# EAGLE design esposi-programmer-v1 (EAGLE 6.6.0)
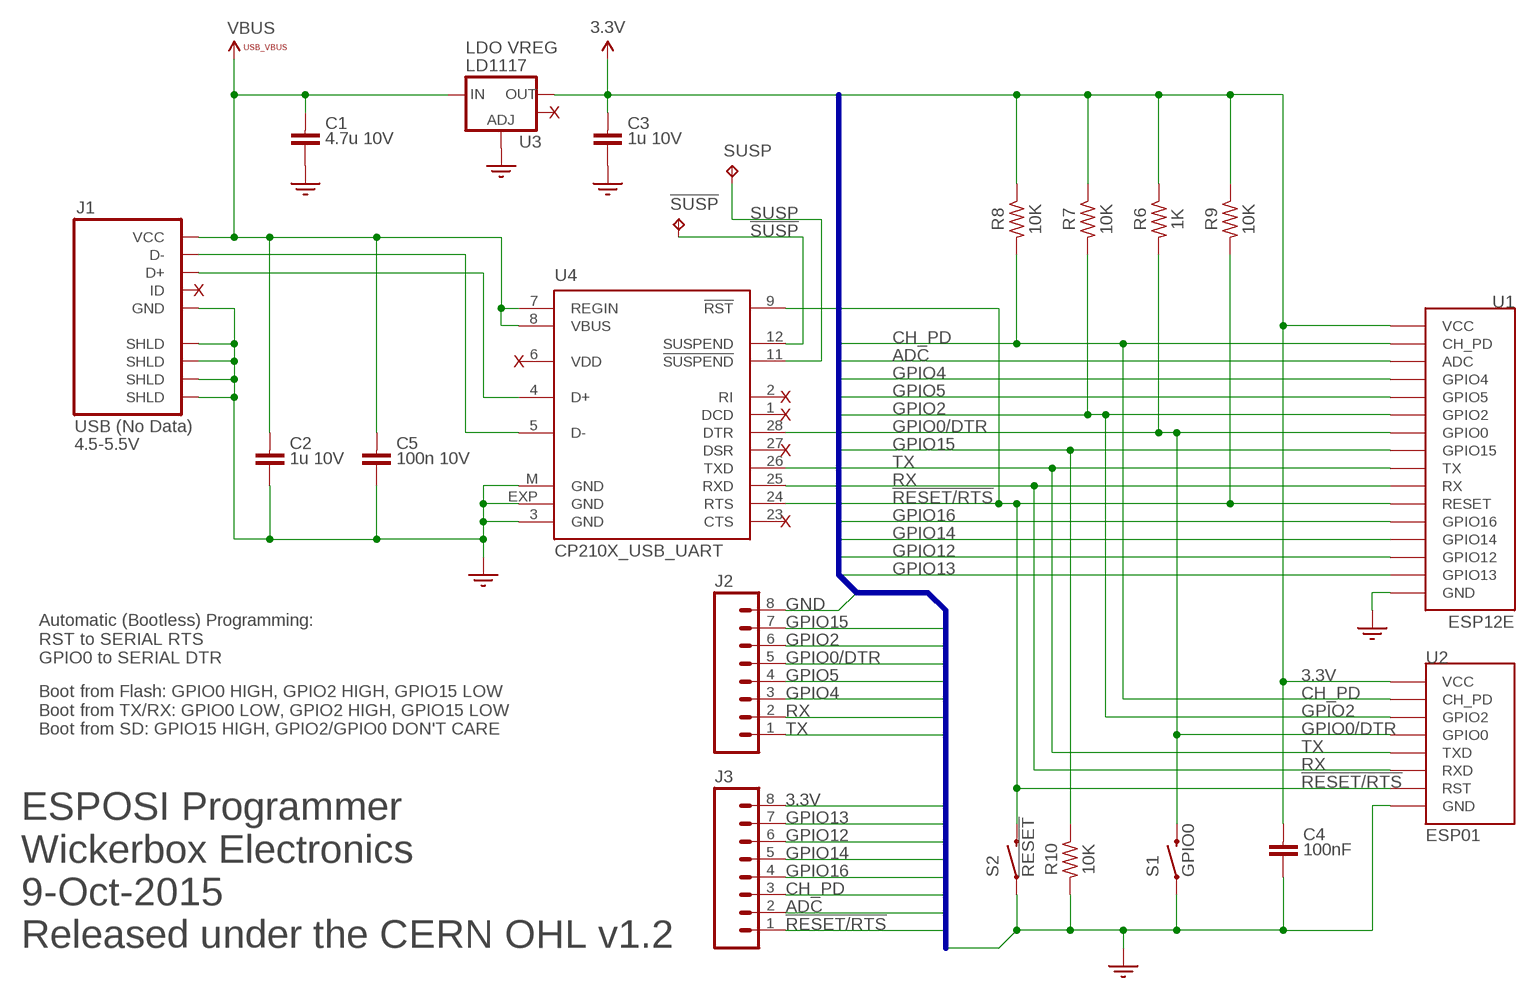
[diagram p0: schematic, sheet 1]

## Parts
!SUSP  TESTPAD_TPB1,27  [TESTPAD_B1,27]
C1  4.7u 10V  CAP-0805  [RLC-0805]
C2  1u 10V  CAP-0603  [RLC-0603]
C3  1u 10V  CAP-0603  [RLC-0603]
C4  100nF  CAP-0402  [RLC-0402]
C5  100n 10V  CAP-0402  [RLC-0402]
J1  USB (No Data)  ZX62D-B-5P8  [ZX62D-B-5P8]
J2  M08NO_SILK_FEMALE_PTH  [1X08_NO_SILK]
J3  M08NO_SILK_FEMALE_PTH  [1X08_NO_SILK]
R6  1K  RES-0402  [RLC-0402]
R7  10K  RES-0402  [RLC-0402]
R8  10K  RES-0402  [RLC-0402]
R9  10K  RES-0402  [RLC-0402]
R10  10K  RES-0402  [RLC-0402]
S1  GPIO0  SWITCH-MOMENTARY-2SMD-1101NE  [TACTILE-SWITCH-1101NE]
S2  !RESET  SWITCH-MOMENTARY-2SMD-1101NE  [TACTILE-SWITCH-1101NE]
SUSP  TESTPAD_TPB1,27  [TESTPAD_B1,27]
U1  ESP12E  ESP12-LONGTH  [ESP12]
U2  ESP01  ESP01-LONG  [ESP01]
U3  V_REG_LM1117SOT223  [SOT223]
U4  CP210X_USB_UART  [MLP28]

## Nets
3.3V: C3.2 C4.1 J3.8 R6.1 R7.1 R8.1 R9.1 U1.VCC U2.VCC U3.2(OUT)
!RESET/RTS: J3.1 R9.2 S2.2 U1.RESET U2.RST U4.9(!RST) U4.24(RTS)
!SUSP: !SUSP.TP U4.12(SUSPEND)
ADC: J3.2 U1.ADC
CH_PD: J3.3 R8.2 U1.CH_PD U2.CH_PD
D+: J1.P3(D+) U4.4(D+)
D-: J1.P2(D-) U4.5(D-)
GND: C1.2 C2.1 C3.1 C4.2 C5.2 J1.P5(GND) J1.P$1(SHLD) J1.P$2(SHLD) J1.P$3(SHLD) J1.P$4(SHLD) J2.8 R10.2 S1.1 S2.1 U1.GND U2.GND U3.1(ADJ) U4.3(GND) U4.EXP(GND) U4.M(GND)
GPIO0/DTR: J2.5 R6.2 S1.2 U1.GPIO0 U2.GPIO0 U4.28(DTR)
GPIO2: J2.6 R7.2 U1.GPIO2 U2.GPIO2
GPIO4: J2.3 U1.GPIO4
GPIO5: J2.4 U1.GPIO5
GPIO12: J3.6 U1.GPIO12
GPIO13: J3.7 U1.GPIO13
GPIO14: J3.5 U1.GPIO14
GPIO15: J2.7 R10.1 U1.GPIO15
GPIO16: J3.4 U1.GPIO16
RX: J2.2 U1.RX U2.RX(RXD) U4.25(RXD)
SUSP: SUSP.TP U4.11(!SUSPEND)
TX: J2.1 U1.TX U2.TX(TXD) U4.26(TXD)
VBUS: C1.1 C2.2 C5.1 J1.P1(VCC) U3.3(IN) U4.7(REGIN) U4.8(VBUS)
Unconnected: J1.P4(ID) U3.4(OUT) U4.1(DCD) U4.2(RI) U4.23(CTS) U4.27(DSR)

## Buses
CH_PD,ADC,GPIO4,GPIO5,GPIO2,GPIO0/DTR,GPIO15,TX,RX,!RESET/RTS,GPIO16,GPIO14,GPIO12,GPIO13,GND,3.3V

## Notes on the sheet
- LDO VREG
- LD1117
- X
- X
- X
- X
- X
- 4.5-5.5V | X
- X
- Automatic (Bootless) Programming:
  RST to SERIAL RTS
  GPIO0 to SERIAL DTR
- Boot from Flash: GPIO0 HIGH, GPIO2 HIGH, GPIO15 LOW
  Boot from TX/RX: GPIO0 LOW, GPIO2 HIGH, GPIO15 LOW
  Boot from SD: GPIO15 HIGH, GPIO2/GPIO0 DON'T CARE
- ESPOSI Programmer
  Wickerbox Electronics
  9-Oct-2015
  Released under the CERN OHL v1.2

## Power pins joined to a net without a drawn wire
VDD: U4.6(VDD)

## Library data of the parts
!SUSP SUSP = foxcar-control-board-v1:TESTPAD_TP: Test pad
C1 = max-viz:CAP-0805
C2 C3 = max-viz:CAP-0603
C4 C5 = max-viz:CAP-0402
J1 = con-hirose-microusb:ZX62D-B-5P8
J2 J3 = SparkFun-Connectors:M08: Header 8 Standard 8-pin 0.1" header. Use with straight break away headers (SKU : PRT-00116), right angle break away headers (PRT-00553), swiss pins (PRT-00743), machine pins (PRT-00117), and female headers (PRT-00115).; PROD_ID: CONN-08438
R6-R10 = max-viz:RES-0402
S1 S2 = SparkFun-Electromechanical:SWITCH-MOMENTARY-2: Various NO switches- pushbuttons, reed, etc; PROD_ID: SWCH-00815
U1 = esp8266modules:ESP12-LONG
U2 = esp8266modules:ESP01-LONG
U3 = SparkFun-PowerIC:V_REG_LM1117: Voltage Regulator LM1117 Standard adjustable voltage regulator but in SMD form. Spark Fun Electronics SKU : COM-00595; PROD_ID: VREG-08170
U4 = SparkFun-DigitalIC:CP210X_USB_UART: Single-Chip USB to UART Bridge Source: www.silabs.com .. CP2101.pdf / cp2102.pdf. Spark Fun Electronics SKU : COM-00310

## Net classes
0 default: clearance 0.178 mm

## Board
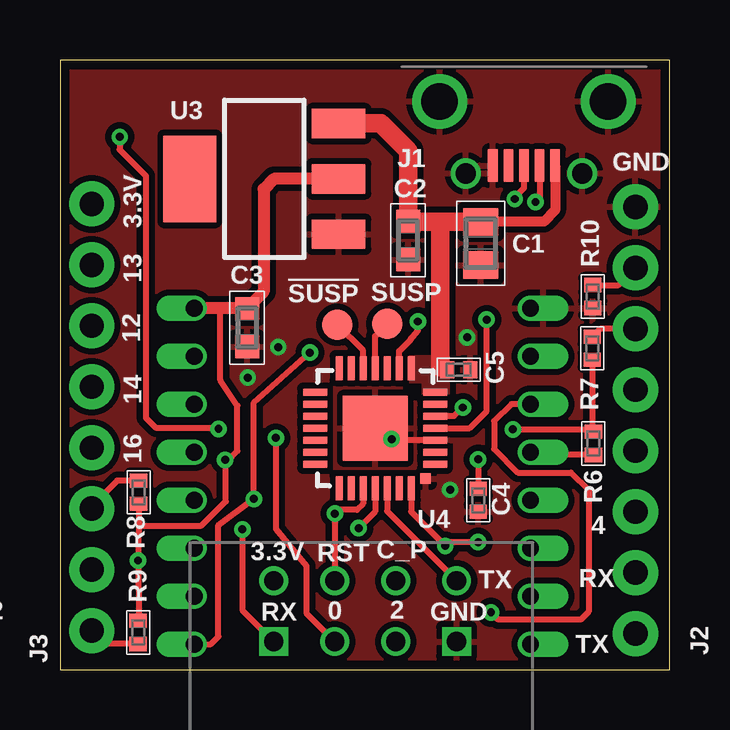
[diagram p1: board, top side]
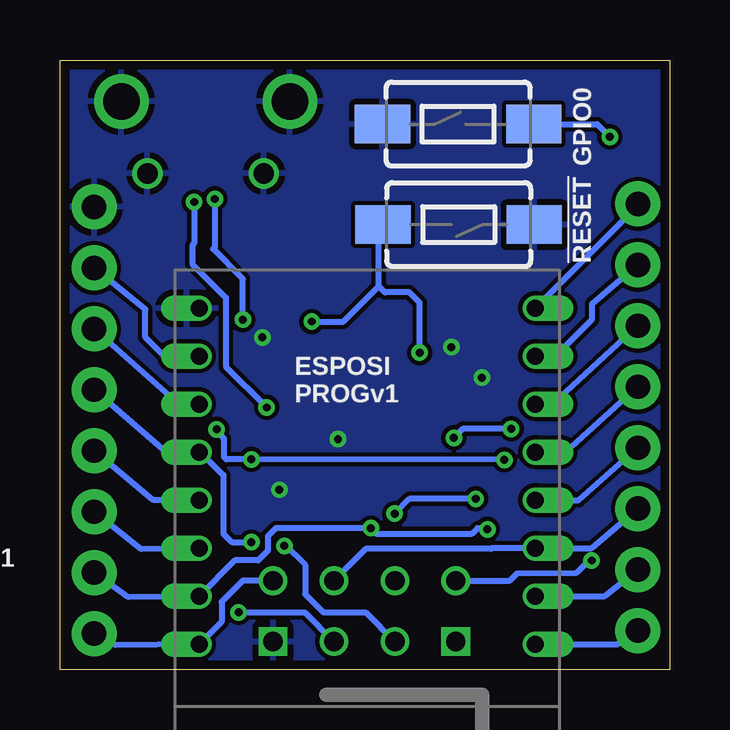
[diagram p2: board, bottom side, seen from below]

Size 25.4 x 25.4 mm. Coordinates in mm from the lower left corner, seen from the top.
Outline: 0,0 25.4,0 25.4,25.4 0,25.4 0,0
Copper layers (1*16): Top 0.0356mm / dielectric 1.5011mm / Bottom 0.0356mm
Design rules "oshpark-2layer": minimum track width 6mil, minimum drill 13mil, track to track 6mil, track to pad 6mil, pad to pad 6mil, via to via 6mil, smd to smd 6mil, copper to edge 15mil, drill to drill 6mil, minimum pad ring 7mil, minimum via ring 7mil, stop-mask expansion 4mil, vias tented up to drill 0mil, thermal gap 10mil

### Footprints (pad centres in the part's own frame; a part is rotated, then mirrored left to right if it is on the bottom)
TESTPAD_B1,27 = smd 1.27 x 1.27: TP 0,0
RLC-0805 = smd 1.15 x 1.45: 1 -0.9,0; 2 0.9,0
RLC-0603 = smd 0.95 x 1: 1 0.8,0; 2 -0.8,0
RLC-0402 = smd 0.59 x 0.72: 1 -0.48,0; 2 0.48,0
ZX62D-B-5P8 = smd 0.4 x 1.35: P1 -1.3,2.675; P2 -0.65,2.675; P3 0,2.675; P4 0.65,2.675; P5 1.3,2.675 | drill 1.524: P$1 3.51,0; P$2 -3.51,0 | drill 0.838: P$3 -2.425,3; P$4 2.425,3
1X08_NO_SILK = drill 1.016 pad 1.88: 1 0,0; 2 2.54,0; 3 5.08,0; 4 7.62,0; 5 10.16,0; 6 12.7,0; 7 15.24,0; 8 17.78,0
TACTILE-SWITCH-1101NE = smd 2.3 x 1.6: 1 -3.15,0; 2 3.15,0
ESP12 = drill 0.7 offset: ADC -7.1,3.8; CH_PD -7.1,1.8; GND 6.9,-8.2; GPIO0 6.9,-2.2; GPIO2 6.9,-4.2; GPIO4 6.9,1.8; GPIO5 6.9,-0.2; GPIO12 -7.1,-4.2; GPIO13 -7.1,-6.2; GPIO14 -7.1,-2.2; GPIO15 6.9,-6.2; GPIO16 -7.1,-0.2; RESET -7.1,5.8; RX 6.9,3.8; TX 6.9,5.8; VCC -7.1,-8.2
ESP01 = drill 0.8: CH_PD -1.285,-8.178; GPIO0 1.255,-5.638; GPIO2 -1.285,-5.638; RST 1.255,-8.178; TX -3.825,-8.178; VCC 3.795,-8.178 | drill 0.8 square: GND -3.825,-5.638; RX 3.795,-5.638
SOT223 = smd 1.219 x 2.235: 1 -2.311,-3.099; 2 0,-3.099; 3 2.311,-3.099 | smd 3.6 x 2.2: 4 0,3.099
MLP28 = smd 1 x 0.3: 1 -2.5,1.5; 2 -2.5,1; 3 -2.5,0.5; 4 -2.5,0; 5 -2.5,-0.5; 6 -2.5,-1; 7 -2.5,-1.5; 15 2.5,-1.5; 16 2.5,-1; 17 2.5,-0.5; 18 2.5,0; 19 2.5,0.5; 20 2.5,1; 21 2.5,1.5 | smd 0.3 x 1: 8 -1.5,-2.5; 9 -1,-2.5; 10 -0.5,-2.5; 11 0,-2.5; 12 0.5,-2.5; 13 1,-2.5; 14 1.5,-2.5; 22 1.5,2.5; 23 1,2.5; 24 0.5,2.5; 25 0,2.5; 26 -0.5,2.5; 27 -1,2.5; 28 -1.5,2.5 | smd 2.7 x 2.7: EXP 0,0 | smd 0.435 x 0.435: M -2.103,2.103

### Placement (x,y rotation side)
!SUSP  11.56,14.38 0 top
C1  17.53,17.75 270 top
C2  14.5,17.88 270 top
C3  7.8,14.25 270 top
C4  17.42,7.06 270 top
C5  16.61,12.5 0 top
J1  19.33,23.67 180 top
J2  23.98,1.5 90 top
J3  1.32,1.63 90 top
R6  22.23,9.42 270 top
R7  22.17,13.39 90 top
R8  3.28,7.39 90 top
R9  3.25,1.55 270 top
R10  22.2,15.54 270 top
S1  8.81,22.73 0 bottom
S2  8.79,18.54 180 bottom
SUSP  13.64,14.4 0 top
U1  12.7,6.86 180 bottom
U2  12.7,-4.47 180 top
U3  8.51,20.45 90 top
U4  13.13,10.06 180 top

### Tracks (layer width: path | path; a pad name or v marks a point on that pad's centre or on a via)
3.3V  (via drill 0.33 pad 0.51)
  Top 0.254: R7.1 22.17,9.95 R6.1 22.12,10.01 v18.87,10.01 | R9.1 3.28,2.06 v3.25,4.55 R8.1 3.28,6.02 3.3,5.99 5.89,5.99 6.91,7.01 6.91,8.71 | 6.91,8.71 6.99,8.71 7.39,9.12 7.39,11 6.68,12.06 6.68,15.06 | 6.91,8.71 v6.88,8.74 | v17.42,8.76 C4.1
  Top 0.508: U3.2 8.91,20.45 8.48,20.02 8.48,15.75 7.8,15.06 | 7.8,15.06 6.68,15.06 U1.VCC | C3.2 7.79,15.05 7.8,15.06
  Bottom 0.254: J3.8 1.6,19.06 U1.VCC | v6.88,8.74 v17.42,8.76 18.47,8.76 18.57,8.87 18.57,9.63 v18.87,10.01 | U2.VCC 6.66,3.71 6.35,4.01 3.86,4.04 3.35,4.55 v3.25,4.55
!RESET/RTS  (via drill 0.33 pad 0.51)
  Top 0.254: R9.2 1.88,1.07 J3.1 | U4.9 14.13,13.27 14.61,13.74 14.61,13.77 14.91,14.12 v14.91,14.5 | U1.RESET 6.29,1.06 6.6,1.37 6.6,6.02 v8.08,7.11 8.08,11.12 v10.41,13.21 | U4.24 12.63,6.92 12.37,6.66 11.61,6.66 v11.46,6.5 U2.RST
  Bottom 0.254: U1.RESET 2.17,1.06 J3.1 | v14.91,14.5 13.59,14.5 12.12,15.98 | 12.12,15.98 12.12,18.36 S2.2 | v10.41,13.21 10.41,15.29 10.85,15.72 11.86,15.72 12.12,15.98 | v8.08,7.11 10.85,7.11 v11.46,6.5
!SUSP
  Top 0.254: U4.12 12.63,13.3 !SUSP.TP
ADC
  Bottom 0.254: U1.ADC 2.71,3.06 J3.2
CH_PD
  Top 0.254: J3.3 1.32,6.81 2.38,7.87 R8.2
  Bottom 0.254: J3.3 3.25,5.06 U1.CH_PD 7.41,5.06 7.44,5.03 12.66,5.03 U2.CH_PD
D+  (via drill 0.33 pad 0.51)
  Top 0.254: J1.P3 19.33,20.07 19.02,19.76 19.02,19.68 v18.95,19.61 | U4.4 17.07,10.06 17.78,10.77 v17.78,14.58
  Bottom 0.254: v18.95,19.61 18.95,17.6 19.02,17.53 17.78,16.28 v17.78,14.58
D-  (via drill 0.33 pad 0.51)
  Top 0.254: J1.P2 19.98,19.65 v19.81,19.48 | v16.79,10.92 16.76,10.92 16.41,10.57 U4.5
  Bottom 0.254: v19.81,19.48 19.81,17.75 19.89,17.68 19.89,16.89 18.49,15.49 18.49,12.62 v16.79,10.92
GND  (via drill 0.33 pad 0.51)
  Top 0.254: 13.63,9.56 v13.82,9.6 13.82,9.4 | U4.3 13.63,9.56 | 13.63,9.56 U4.EXP | U4.M 15.23,7.98
  other vias: 16.97,13.84 9.09,13.44 7.82,12.17 16.26,7.49
  pour Bottom (rank 3): 0,-0.25 25.65,-0.25 25.65,25.4 0,25.4
  pour Top (isolate 0.254, rank 5): 0,-0.25 25.65,-0.25 25.4,25.4 0,25.4
GPIO0/DTR  (via drill 0.33 pad 0.51)
  Top 0.254: R6.2 19.71,8.94 U1.GPIO0 | v2.49,22.2 2.49,21.67 3.58,20.57 3.58,10.49 3.99,10.08 6.55,10.08 v6.6,10.03 | v8.99,9.65 8.99,5.87 10.26,4.32 10.26,2.35 U2.GPIO0 | U4.28 14.63,6.58 v16.05,5.16 16.2,5.31 v17.42,5.31
  Bottom 0.254: J2.5 20.97,9.06 U1.GPIO0 19.55,9.06 18.59,8.1 18.59,5.66 18.24,5.31 v17.42,5.31 | S1.2 3.02,22.73 v2.49,22.2 | v6.6,10.03 8.61,10.03 v8.99,9.65 | v16.05,5.16 16.05,5.23 15.19,4.37 15.19,3.15 14.43,2.39 12.66,2.39 U2.GPIO0
GPIO2  (via drill 0.33 pad 0.51)
  Top 0.254: J2.6 22.51,14.2 R7.2 | U1.GPIO2 18.8,11.06 18.09,10.36 18.09,9.2 19.07,8.2 21.29,8.2 22.02,7.47 22.02,2.41 21.69,2.08 18.26,2.08 v17.96,2.39
  Bottom 0.254: J2.6 20.43,11.06 U1.GPIO2 | v17.96,2.39 15.21,2.39 U2.GPIO2
GPIO4
  Bottom 0.254: U1.GPIO4 22.01,5.02 J2.3
GPIO5
  Bottom 0.254: U1.GPIO5 21.51,7.06 J2.4
GPIO12
  Bottom 0.254: U1.GPIO12 4.87,11.06 J3.6
GPIO13
  Bottom 0.254: U1.GPIO13 4.77,13.06 3.23,14.61 3.23,15.24 J3.7
GPIO14
  Bottom 0.254: U1.GPIO14 4.33,9.06 J3.5
GPIO15
  Top 0.254: R10.1 23.26,16.02 J2.7
  Bottom 0.254: U1.GPIO15 21.06,13.06 21.84,13.84 21.84,15.01 J2.7
GPIO16
  Bottom 0.254: U1.GPIO16 3.79,7.06 J3.4
RX  (via drill 0.33 pad 0.51)
  Top 0.254: U4.25 13.13,6.58 v12.45,5.89 | v7.59,5.84 7.59,2.48 U2.RX
  Bottom 0.254: J2.2 22.55,3.02 U1.RX 18.11,4.55 17.14,4.55 16.74,4.95 16.74,5.56 16.41,5.89 v12.45,5.89 12.29,5.71 12.24,5.66 8.23,5.66 8,5.89 7.64,5.89 v7.59,5.84
SUSP
  Top 0.254: U4.11 13.13,13.89 SUSP.TP
TX
  Top 0.254: U4.26 13.63,6.6 U2.TX
  Bottom 0.254: J2.1 23.09,1.02 U1.TX 18.67,1.99 18.67,2.82 17.78,3.71 U2.TX
VBUS
  Top 0.406: J1.P1 20.63,19.13 20.17,18.67 C1.1
  Top 0.762: U3.3 13.36,22.76 14.5,21.61 C2.2 14.63,18.66 15.76,18.66 15.85,18.67 | 15.85,18.67 15.85,12.6 | C1.1 15.91,18.66 15.85,18.67
  pour Top (isolate 0.254, no thermals): 14.5,13.03 16.18,13.03 16.18,11.4 15.14,11.43 15.14,11.99 14.48,11.99

### Text on the board
tPlace: GND | 3.3V | 13 | 12 | 14 | 16 | 4 | 3.3V | C_P | RST | TX | RX | RX | 0 | 2 | GND | TX
bPlace: ESPOSI / PROGv1